# EAGLE design OpenKobold (EAGLE 6.1)
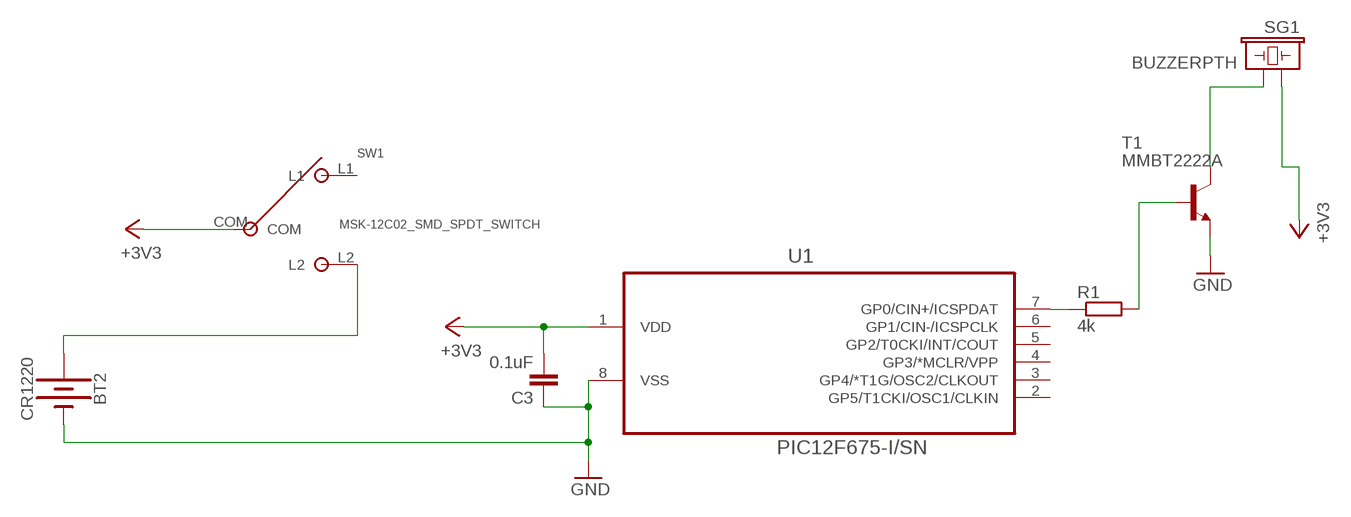
[diagram p0: schematic, sheet 1]

## Parts
BT2  CR1220  BATTERY-12MM_SMD  [BATTCON_12MM]
C3  0.1uF  C-EUC0805  [C0805]
R1  4k  R-EU_R0805  [R0805]
SG1  BUZZERPTH  [BUZZER-12MM]
SW1  MSK-12C02_SMD_SPDT_SWITCH  [MSK-12C02]
T1  MMBT2222A  MMBT2222ALT1-NPN-SOT23-BEC  [SOT23-BEC]
U1  PIC12F675-I/SN  [SOIC127P600X175-8N]

## Nets
+3V3: C3.2 SG1.+ SW1.COM U1.1(VDD)
GND: BT2.GND@1(-) C3.1 T1.E U1.8(VSS)
N$3: R1.2 T1.B
N$4: SG1.- T1.C
N$5: R1.1 U1.7(GP0/CIN+/ICSPDAT)
N$6: BT2.PWR@1(+) SW1.L2
Unconnected: SW1.L1 U1.2(GP5/T1CKI/OSC1/CLKIN) U1.3(GP4/*T1G/OSC2/CLKOUT) U1.4(GP3/*MCLR/VPP) U1.5(GP2/T0CKI/INT/COUT) U1.6(GP1/CIN-/ICSPCLK)

## Library data of the parts
BT2 = seitan:BATTERY: Battery - Single Cell A variety of battery chemistries, sizes, and footprints. Device List: 20MM_PTH - Coin Cell Battery Holder - 20mm (PTH) <https://www.sparkfun.com/products/783> 6.8MM_PTH - Coin Cell Battery Holder - 6.8MM(SMD) <https://www.digikey.com/product-detail/en/seiko-instruments/MS621FE-FL11E/728-1057-ND/1889208?WT.srch=1&gclid=CNOQ5a6LzdQCFZS2wAodXCkE0g> 12MM_SMD - Coin Cell Battery Holder - 12mm (SMD) <https://www.sparkfun.com/products/10592> 12MM_PTH - Coin Cell Battery Holder - 12mm (PTH) <https://www.sparkfun.com/products/7948> 20MM_SMD - 20mm Coin Cell Battery Holder (SMD) (2 legs) Used on the Big Time Watch Kit <https://www.sparkfun.com/products/11734> 20MM_SMD_4LEGS - Coin Cell Battery Holder - 20mm (SMD) <https://www.sparkfun.com/products/11892> 20MM_SMD_4LEGS_OVERPASTE - Coin Cell Battery Holder - 20mm (SMD) <https://www.sparkfun.com/products/11892> (Over-paste on the legs) 24.5MM_PTH - Coin Cell Battery Holder - 24.5mm (PTH) <https://www.sparkfun.com/products/8863> 9V - 9V Battery Holder - PC Mount Used on the SparkFun SparkPunk Sound Kit <https://www.sparkfun.com/products/11177> and SparkFun SparkPunk Sequencer Kit <https://www.sparkfun.com/products/12707> 18650 - Battery Holder - 18650 (PTH) <https://www.sparkfun.com/products/13113> AA - Battery Holder - 1xAA (PTH) <https://www.sparkfun.com/products/7949> AAA - Battery Holder - 1xAAA (PTH) <https://www.sparkfun.com/products/12718> AA_KIT - Battery Holder - 1xAA (PTH) <https://www.sparkfun.com/products/7949> Special kit package - pads only have exposed copper on one side of the board. AAA_KIT - Battery Holder - 1xAAA (PTH) <https://www.sparkfun.com/products/12718> Special kit package - pads only have exposed copper on one side of the board.; PROD_ID: BATT-08044; SF_SKU: PRT-10592
C3 = rcl:C-EU: CAPACITOR, European symbol
R1 = rcl:R-EU_: RESISTOR, European symbol
SG1 = SparkFun:BUZZER: Buzzer 12mm Spark Fun Electronics SKU : Comp-Buzzer
SW1 = MSK-12C02 SMD Micro Slider Switch SPDT:MSK-12C02_SMD_SPDT_SWITCH: Footprint of the VIMEX MSK-12C02 SPDT SMD Switch Created by mzst on 17-Jan-2016
T1 = transistor:*-NPN-: NPN Transistror BF959 corrected 2008.03.06
U1 = Microchip_By_element14_Batch_1:PIC12F675-I/SN: 8BIT FLASH MCU, SMD, 12F675; MPN: PIC12F675-I/SN; OC_FARNELL: 9759026; OC_NEWARK: 80K7313; PACKAGE: SOIC-8; SUPPLIER: MICROCHIP

## Board
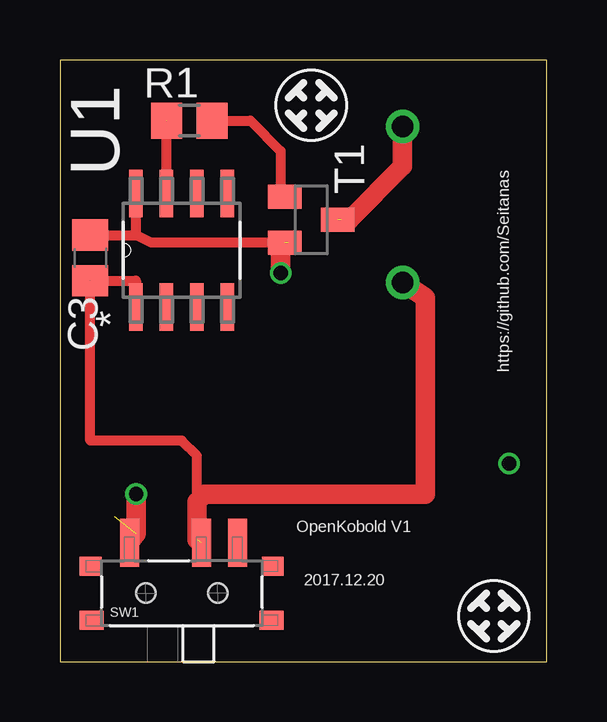
[diagram p1: board, top side]
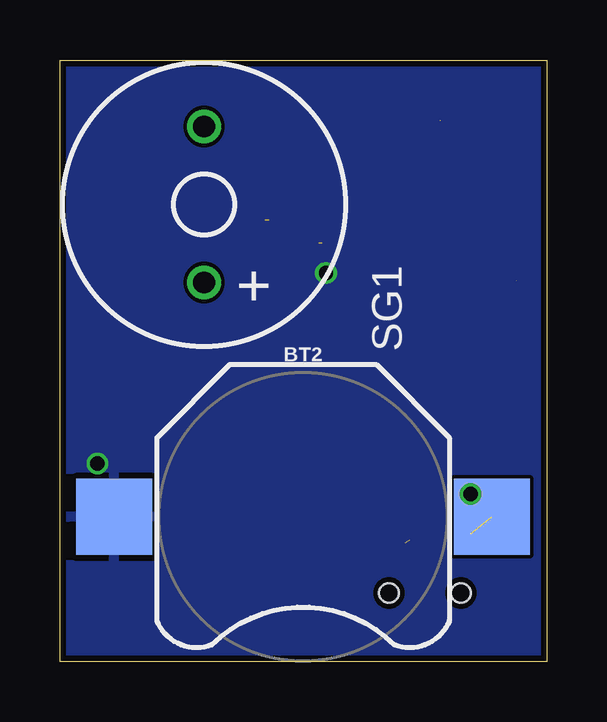
[diagram p2: board, bottom side, seen from below]

Size 20.3 x 25.07 mm. Coordinates in mm from the lower left corner, seen from the top.
Outline: 0,0 20.3,0 20.3,25.07 0,25.07 0,0
Copper layers (1*16): Top 0.035mm / dielectric 1.5mm / Bottom 0.035mm
Design rules: minimum track width 6mil, minimum drill 12mil, track to track 6mil, track to pad 6mil, pad to pad 6mil, via to via 6mil, smd to smd 0mil, copper to edge 10mil, drill to drill 10mil, minimum pad ring 10mil, minimum via ring 6mil, stop-mask expansion 2mil, vias tented up to drill 100mil, thermal gap 10mil

### Footprints (pad centres in the part's own frame; a part is rotated, then mirrored left to right if it is on the bottom)
BATTCON_12MM = smd 3.175 x 3.175: GND@1 7.874,0; PWR@1 -7.874,0
C0805 = smd 1.3 x 1.5: 1 -0.95,0; 2 0.95,0
R0805 = smd 1.3 x 1.5: 1 -0.95,0; 2 0.95,0
BUZZER-12MM = drill 0.9: + 3.25,0; - -3.25,0
MSK-12C02 = smd 0.8 x 2: COM 0.823,2.1; L1 2.323,2.1; L2 -2.177,2.1 | smd 1 x 0.8: GND@1 -3.75,-1.125; GND@4 3.75,-1.125 | smd 0.9 x 0.8: GND@2 -3.8,1.125; GND@3 3.8,1.125 | hole 0.8: -1.5,0; 1.5,0
SOT23-BEC = smd 1 x 1.4: B -0.95,-1.1; C 0,1.1; E 0.95,-1.1
SOIC127P600X175-8N = smd 1.981 x 0.559: 1 -2.362,1.905; 2 -2.362,0.635; 3 -2.362,-0.635; 4 -2.362,-1.905; 5 2.362,-1.905; 6 2.362,-0.635; 7 2.362,0.635; 8 2.362,1.905

### Placement (x,y rotation side)
BT2  10.16,6.03 180 bottom
C3  1.27,16.83 270 top
R1  5.4,22.54 0 top
SG1  14.29,19.05 270 bottom
SW1  5.08,2.86 0 top
T1  10.48,18.42 270 top
U1  5.08,17.14 90 top
U$2  [TADAS]  18.73,1.59 0 top
U$3  [TADAS]  11.11,22.86 0 top

### Tracks (layer width: path | path; a pad name or v marks a point on that pad's centre or on a via)
+3V3  (2 unrouted)
  Top 0.406: C3.2 3.17,15.88 U1.1 | 5.71,5.08 5.71,8.57 5.08,9.21 1.27,9.21 C3.2
  Top 0.813: SG1.+ 15.24,15.17 15.24,6.99 6.03,6.99 5.71,6.67 5.71,5.08
GND  (via drill 0.6)  (1 unrouted)
  Top 0.406: C3.1 3.17,17.78 | 3.17,17.78 U1.8 | 3.17,17.78 3.81,17.46 7.62,17.46 8.26,17.46 T1.E 9.52,17.32
  Top 0.813: v9.21,16.19 9.21,17.14 9.52,17.46
  other vias: 18.73,8.25
  pour Bottom: 0.32,24.76 20,24.76 20,0.32 0.32,0.32
N$3
  Top 0.406: R1.2 7.94,22.54 9.21,21.27 9.21,19.54 T1.B
N$4  (1 unrouted)
  Top 0.813: SG1.- 14.29,20.64 12.06,18.42 11.75,18.42
N$5  (1 unrouted)
  Top 0.406: U1.7 R1.1
N$6  (via drill 0.6)  (1 unrouted)
  Top 0.813: SW1.L2 3.17,5.32 v3.17,6.99

### Text on the board
tPlace: https://github.com/Seitanas | OpenKobold V1 | 2017.12.20